# EAGLE design rp-DAC (EAGLE 9.6.2)
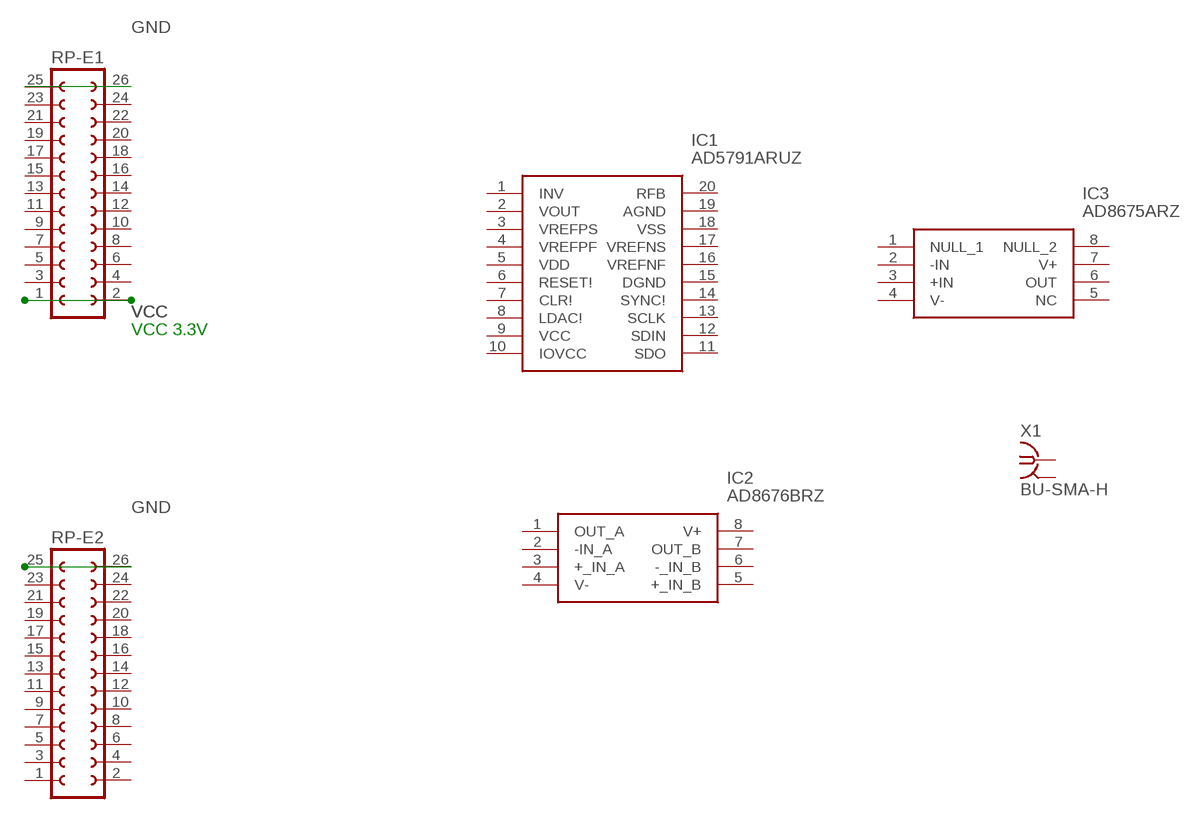
[diagram p0: schematic, sheet 1]

## Parts
IC1  AD5791ARUZ  [SOP65P640X120-20N]
IC2  AD8676BRZ  [SOIC127P600X175-8N]
IC3  AD8675ARZ  [SOIC127P600X175-8N]
RP-E1  FE13-2  [FE13-2]
RP-E2  FE13-2  [FE13-2]
X1  BU-SMA-H  [BU-SMA-H]

## Nets
GND: RP-E1.25 RP-E1.26 RP-E2.25 RP-E2.26
VCC: RP-E1.1 RP-E1.2
Unconnected: IC1.1(INV) IC1.2(VOUT) IC1.3(VREFPS) IC1.4(VREFPF) IC1.5(VDD) IC1.6(RESET!) IC1.7(CLR!) IC1.8(LDAC!) IC1.9(VCC) IC1.10(IOVCC) IC1.11(SDO) IC1.12(SDIN) IC1.13(SCLK) IC1.14(SYNC!) IC1.15(DGND) IC1.16(VREFNF) IC1.17(VREFNS) IC1.18(VSS) IC1.19(AGND) IC1.20(RFB) IC2.1(OUT_A) IC2.2(-IN_A) IC2.3(+_IN_A) IC2.4(V-) IC2.5(+_IN_B) IC2.6(-_IN_B) IC2.7(OUT_B) IC2.8(V+) IC3.1(NULL_1) IC3.2(-IN) IC3.3(+IN) IC3.4(V-) IC3.5(NC) IC3.6(OUT) IC3.7(V+) IC3.8(NULL_2) RP-E1.3 RP-E1.4 RP-E1.5 RP-E1.6 RP-E1.7 RP-E1.8 RP-E1.9 RP-E1.10 RP-E1.11 RP-E1.12 RP-E1.13 RP-E1.14 RP-E1.15 RP-E1.16 RP-E1.17 RP-E1.18 RP-E1.19 RP-E1.20 RP-E1.21 RP-E1.22 RP-E1.23 RP-E1.24 RP-E2.1 RP-E2.2 RP-E2.3 RP-E2.4 RP-E2.5 RP-E2.6 RP-E2.7 RP-E2.8 RP-E2.9 RP-E2.10 RP-E2.11 RP-E2.12 RP-E2.13 RP-E2.14 RP-E2.15 RP-E2.16 RP-E2.17 RP-E2.18 RP-E2.19 RP-E2.20 RP-E2.21 RP-E2.22 RP-E2.23 RP-E2.24 X1.1 X1.2 X1.3 X1.4 X1.5

## Notes on the sheet
- VCC 3.3V

## Library data of the parts
IC1 = AD5791ARUZ:AD5791ARUZ: Analog Devices AD5791ARUZ, 20 bit Serial DAC, 20-Pin TSSOP Source: Datasheet; ARROW_PART_NUMBER: AD5791ARUZ; ARROW_PRICE-STOCK: https://www.arrow.com/en/products/ad5791aruz/maxim-integrated?region=nac; DESCRIPTION: Analog Devices AD5791ARUZ, 20 bit Serial DAC, 20-Pin TSSOP; HEIGHT: mm; MANUFACTURER_NAME: Analog Devices; MANUFACTURER_PART_NUMBER: AD5791ARUZ; MOUSER_PART_NUMBER: 584-AD5791ARUZ; MOUSER_PRICE-STOCK: https://www.mouser.co.uk/ProductDetail/Analog-Devices/AD5791ARUZ?qs=NmRFExCfTkFFzkQEIb8Zgg%3D%3D
IC2 = AD8676BRZ:AD8676BRZ: AD8676BRZ, Dual Operational Amplifier 10MHz Rail-Rail, 8-Pin SOIC Source: Datasheet <http://www.analog.com/static/imported-files/data_sheets/AD8676.pdf>; ARROW_PART_NUMBER: AD8676BRZ; ARROW_PRICE-STOCK: https://www.arrow.com/en/products/ad8676brz/analog-devices; DESCRIPTION: AD8676BRZ, Dual Operational Amplifier 10MHz Rail-Rail, 8-Pin SOIC; HEIGHT: 1.75mm; MANUFACTURER_NAME: Analog Devices; MANUFACTURER_PART_NUMBER: AD8676BRZ; MOUSER_PART_NUMBER: 584-AD8676BRZ; MOUSER_PRICE-STOCK: https://www.mouser.co.uk/ProductDetail/Analog-Devices/AD8676BRZ?qs=%2FtpEQrCGXCywkTTL2opozg%3D%3D
IC3 = AD8675ARZ:AD8675ARZ: Precision Amplifiers 2.5nV R-R out Precision BP AMP Source: Datasheet <https://www.analog.com/media/en/technical-documentation/data-sheets/AD8675.pdf>; ARROW_PART_NUMBER: AD8675ARZ; ARROW_PRICE-STOCK: https://www.arrow.com/en/products/ad8675arz/analog-devices; DESCRIPTION: Precision Amplifiers 2.5nV R-R out Precision BP AMP; HEIGHT: 1.75mm; MANUFACTURER_NAME: Analog Devices; MANUFACTURER_PART_NUMBER: AD8675ARZ; MOUSER_PART_NUMBER: 584-AD8675ARZ; MOUSER_PRICE-STOCK: https://www.mouser.co.uk/ProductDetail/Analog-Devices/AD8675ARZ?qs=%2FtpEQrCGXCyRAPqNwuQ%2Fog%3D%3D
RP-E1 RP-E2 = con-lsta:FE13-2: FEMALE HEADER; OC_FARNELL: unknown; OC_NEWARK: unknown
X1 = con-coax:BU-SMA-H: FEMALE SMA CONNECTOR Radiall; OC_FARNELL: unknown; OC_NEWARK: unknown

## Board
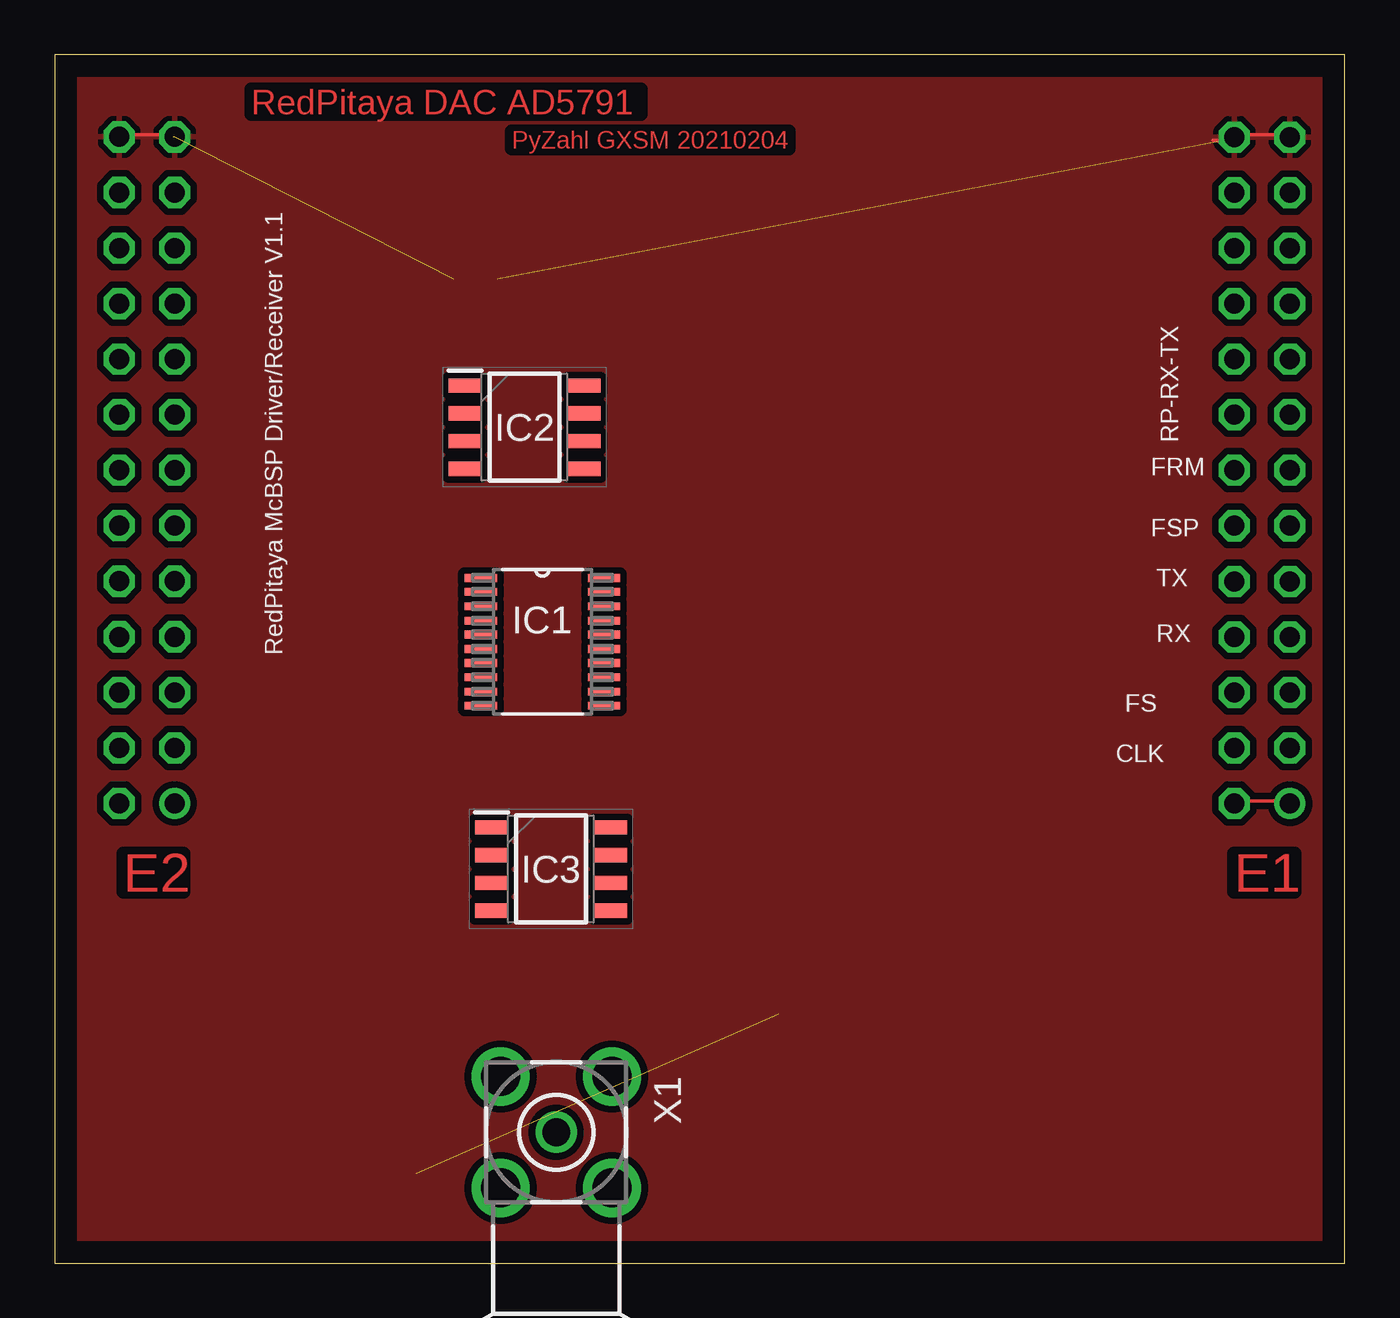
[diagram p1: board, top side]
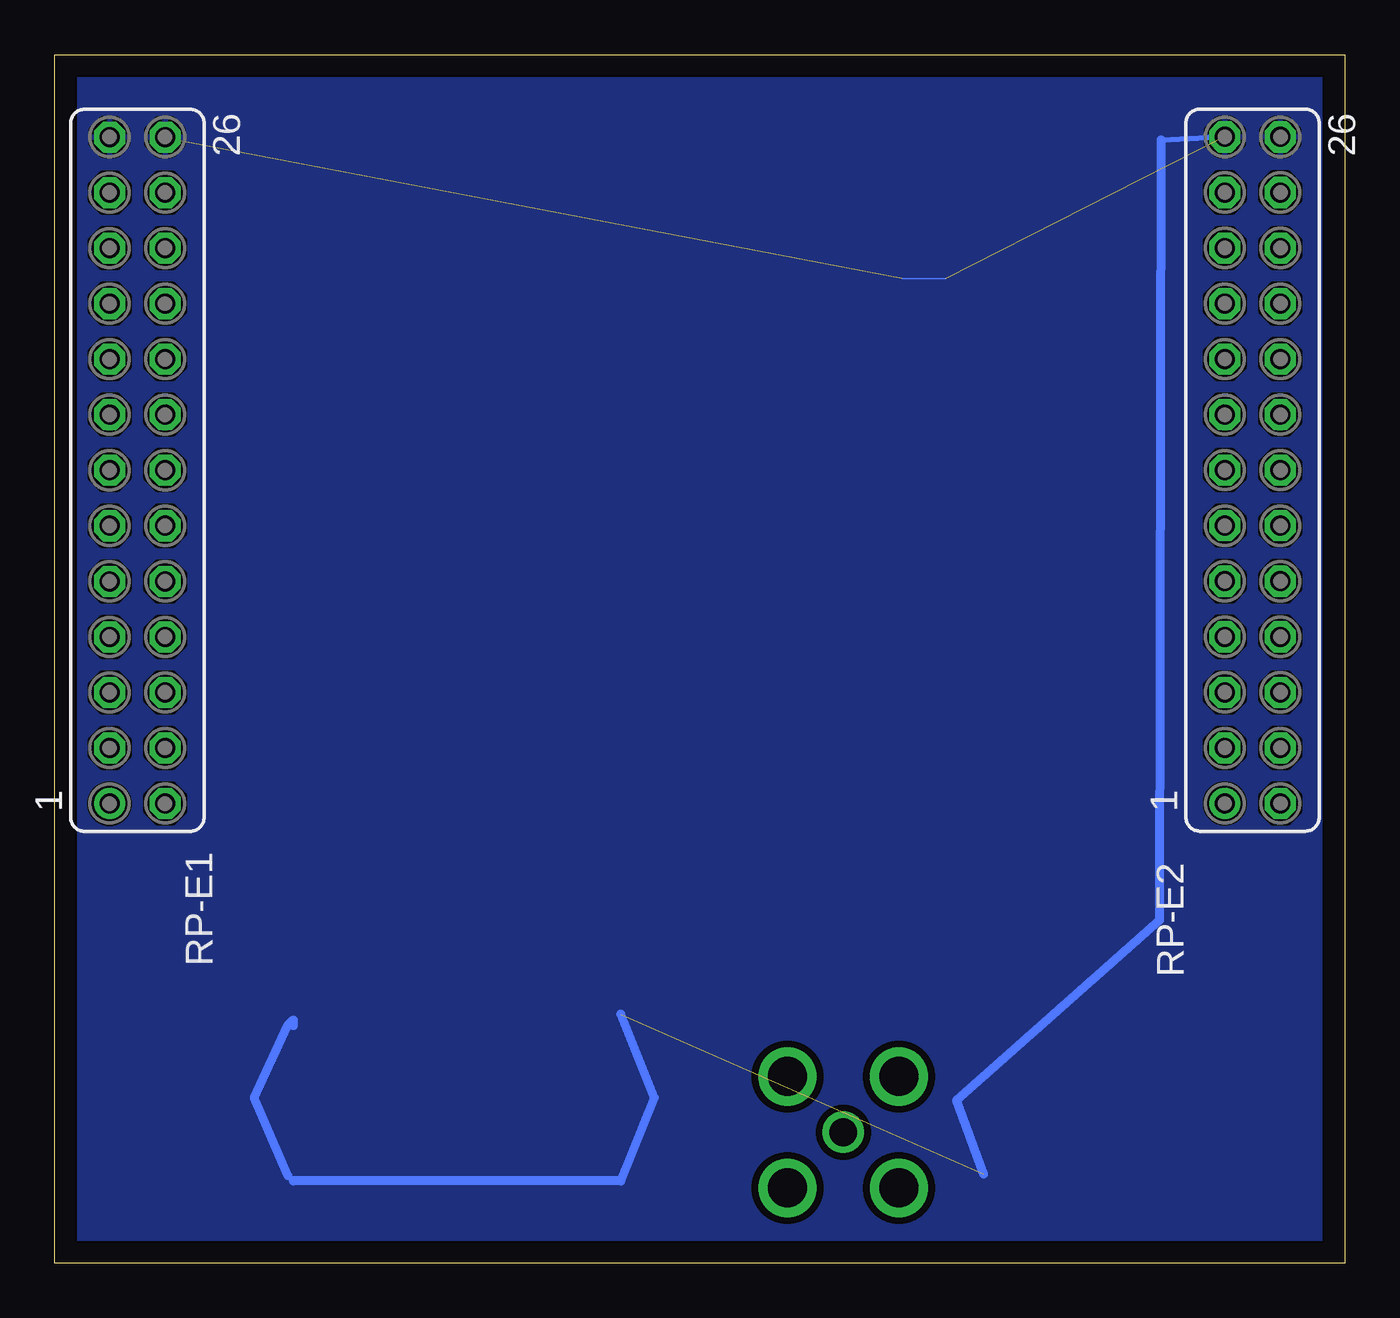
[diagram p2: board, bottom side, seen from below]

Size 59 x 55.27 mm. Coordinates in mm from the lower left corner, seen from the top.
Outline: 0,0 59,0 59,55.27 0,55.27 0,0
Copper layers (1*16): Top 0.035mm / dielectric 1.5mm / Bottom 0.035mm
Design rules "default": minimum track width 6mil, minimum drill 0.35mm, track to track 6mil, track to pad 6mil, pad to pad 6mil, via to via 6mil, smd to smd 6mil, copper to edge 40mil, drill to drill 6mil, minimum pad ring 10mil, minimum via ring 8mil, stop-mask expansion 4mil, vias tented up to drill 0mil, thermal gap 10mil

### Footprints (pad centres in the part's own frame; a part is rotated, then mirrored left to right if it is on the bottom)
SOP65P640X120-20N = smd 1.473 x 0.356: 1 -2.819,2.921; 2 -2.819,2.286; 3 -2.819,1.626; 4 -2.819,0.965; 5 -2.819,0.33; 6 -2.819,-0.33; 7 -2.819,-0.965; 8 -2.819,-1.626; 9 -2.819,-2.286; 10 -2.819,-2.921; 11 2.819,-2.921; 12 2.819,-2.286; 13 2.819,-1.626; 14 2.819,-0.965; 15 2.819,-0.33; 16 2.819,0.33; 17 2.819,0.965; 18 2.819,1.626; 19 2.819,2.286; 20 2.819,2.921
SOIC127P600X175-8N = smd 1.525 x 0.65: 1 -2.712,1.905; 2 -2.712,0.635; 3 -2.712,-0.635; 4 -2.712,-1.905; 5 2.712,-1.905; 6 2.712,-0.635; 7 2.712,0.635; 8 2.712,1.905
FE13-2 = drill 0.914: 1 -15.24,1.27 | drill 0.914 octagon: 2 -15.24,-1.27; 3 -12.7,1.27; 4 -12.7,-1.27; 5 -10.16,1.27; 6 -10.16,-1.27; 7 -7.62,1.27; 8 -7.62,-1.27; 9 -5.08,1.27; 10 -5.08,-1.27; 11 -2.54,1.27; 12 -2.54,-1.27; 13 0,1.27; 14 0,-1.27; 15 2.54,1.27; 16 2.54,-1.27; 17 5.08,1.27; 18 5.08,-1.27; 19 7.62,1.27; 20 7.62,-1.27; 21 10.16,1.27; 22 10.16,-1.27; 23 12.7,1.27; 24 12.7,-1.27; 25 15.24,1.27; 26 15.24,-1.27
BU-SMA-H = drill 1.27: 1 0,0 | drill 1.778: 2 -2.55,2.55; 3 2.55,2.55; 4 2.55,-2.55; 5 -2.55,-2.55

### Placement (x,y rotation side)
IC1  22.31,28.42 0 top
IC2  21.48,38.24 0 top
IC3  22.69,18.03 0 top
RP-E1  55.22,36.26 90 bottom
RP-E2  4.22,36.27 90 bottom
X1  22.94,5.99 270 top

### Tracks (layer width: path | path; a pad name or v marks a point on that pad's centre or on a via)
GND  (4 unrouted)
  Top 0.152: 53.83,51.36 52.96,51.36 53.22,51.31 | 53.98,51.62 53.98,51.51 53.83,51.46 53.83,51.36 | 53.98,51.62 RP-E1.26 | 56.42,51.62 RP-E1.25 | 56.42,51.62 53.98,51.62 | 53.98,51.62 53.83,51.36 | 56.42,51.62 56.42,51.51 | RP-E2.26 3.08,51.62 5.37,51.62 RP-E2.25
  Bottom 0.076: 18.25,45.04 20.26,45.03
  Bottom 0.254: 8.4,51.37 5.42,51.51
  Bottom 0.305: 13.07,11.7 13.13,11.55 | 48.09,3.76 48.34,4.02
  Bottom 0.406: 16.53,4.08 17.75,7.44 13.13,11.55 8.46,15.7 8.4,51.37 | 48.09,3.76 33.1,3.76 31.58,7.57 33.1,11.38 | 48.34,4.02 49.87,7.57 48.34,10.87 48.09,11.13 48.09,10.87
  pour Top (isolate 0.305): 59.01,-0.05 59.01,55.32 -0.17,55.32 -0.17,-0.05
  pour Bottom (isolate 0.305): 59.01,-0.05 59.01,55.32 -0.17,55.32 -0.17,-0.05
VCC
  Top 0.152: 53.32,21.14 53.83,21.03 53.98,21.14 | 53.32,21.14 RP-E1.2 | RP-E1.1 56.42,21.14 53.98,21.14 | 53.98,21.14 53.98,21.03 53.32,21.14

### Text on the board
Top: RedPitaya DAC AD5791 | PyZahl GXSM 20210204 | E2 | E1
tNames: RP-RX-TX | FRM | FSP | TX | RX | RedPitaya McBSP Driver/Receiver V1.1 | FS | CLK
205bmp: /home/pzahl/BNLBox/RedPitayaPAC/Extension_connector.bmp